# Altium schematic sheet 01 COVER.SchDoc
size A2; ApprovedBy: DNP; CheckedBy: DNP; Author: DNP; CompanyName: Google LLC; DrawnBy: DNP; Organization: Google LLC; Address1: 1600 Amphitheatre Parkway; Address2: Mountain View, CA 94043; Address3: DNP; Address4: DNP; DocumentNumber: 1; SheetNumber: 1; SheetTotal: 17; VersionControl_RevNumber: DNP; IsUserConfigurable: DNP; Time: DNP; ImagePath: DNP; Rule: DNP; ProjectName: Enterprise; Application_BuildNumber: DNP
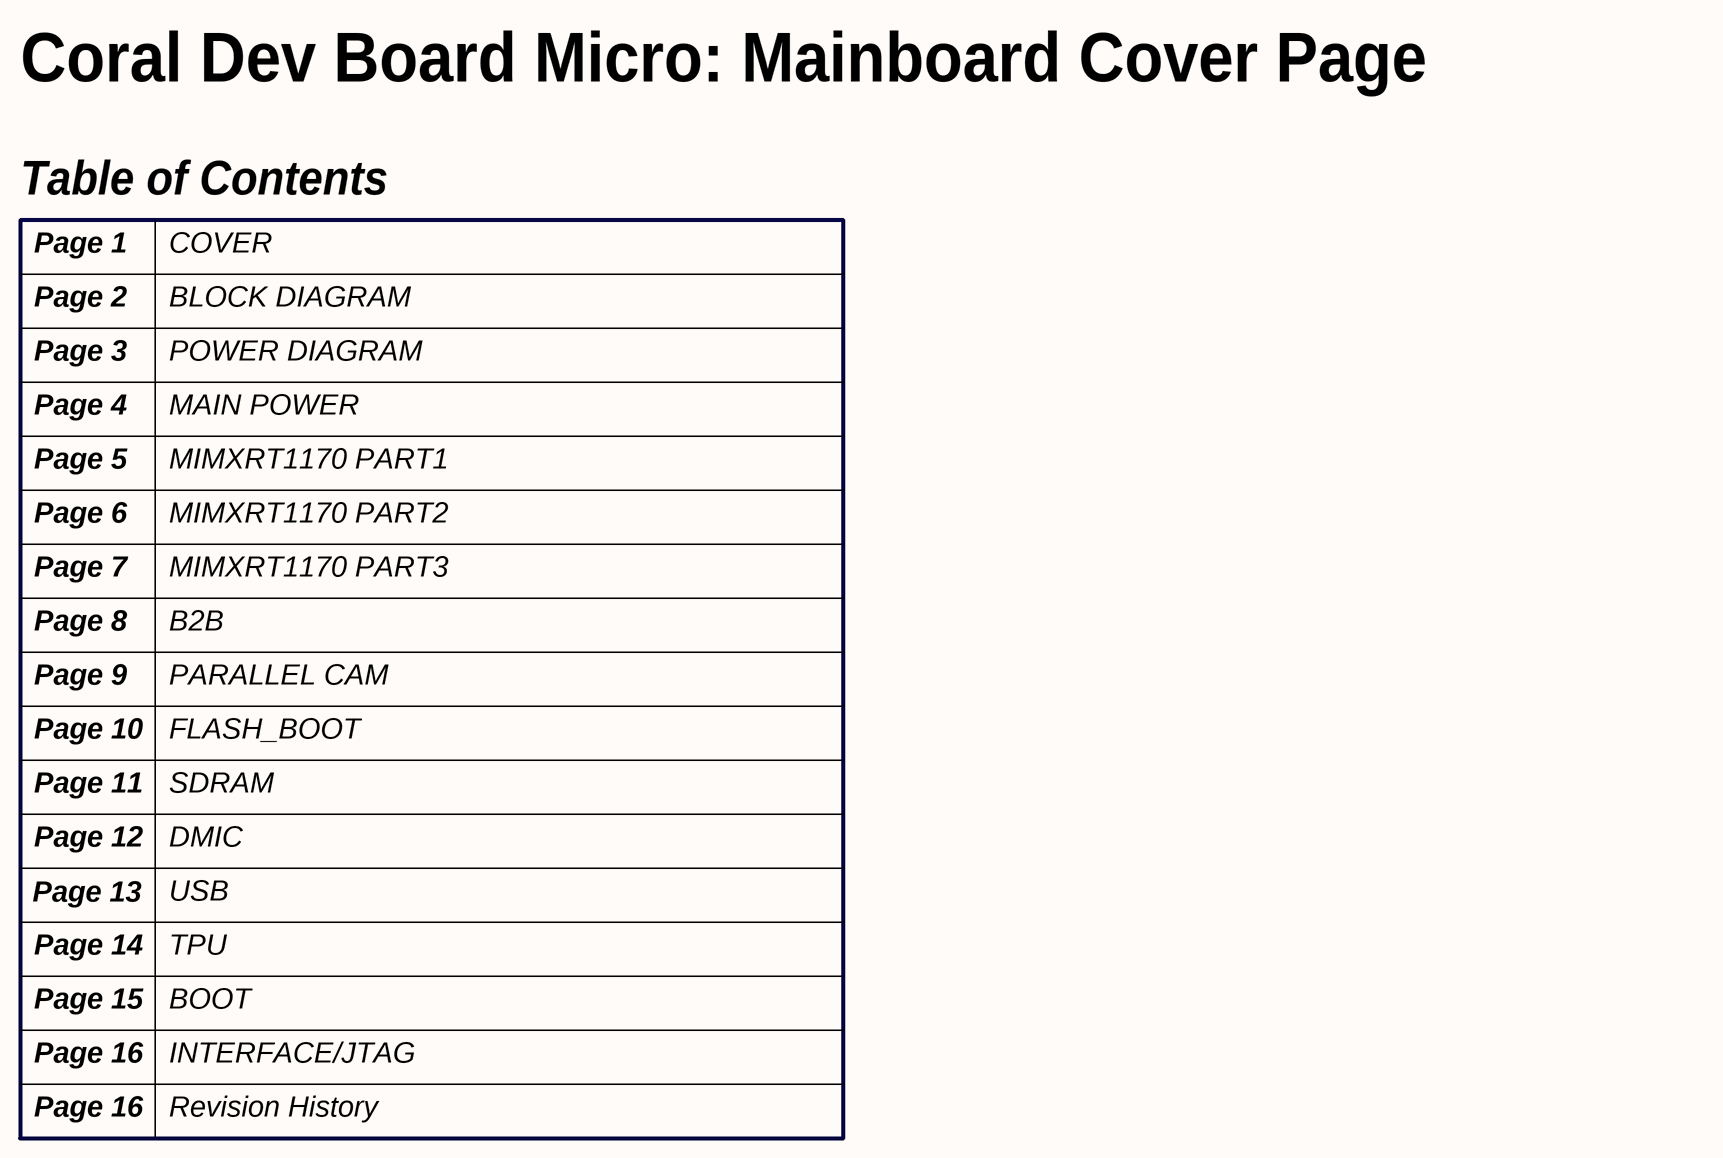
[diagram p0: 01 COVER.SchDoc]

## Notes on the sheet
- Coral Dev Board Micro: Mainboard Cover Page
- Table of Contents
- Page 1
- Page 2
- COVER
- BLOCK DIAGRAM
- Page 3
- POWER DIAGRAM
- Page 4
- MAIN POWER
- Page 5
- MIMXRT1170 PART1
- Page 6
- Page 7
- MIMXRT1170 PART3
- MIMXRT1170 PART2
- Page 8
- B2B
- Page 9
- PARALLEL CAM
- Page 10
- FLASH_BOOT
- Page 11
- Page 12
- SDRAM
- DMIC
- Page 13
- USB
- Page 14
- TPU
- Page 15
- BOOT
- Page 16
- INTERFACE/JTAG
- Revision History
- Project:
- Engineer:
- Date:
- File:
- Revision:
- Sheet
- of